# EAGLE design monotype_punch_interface (EAGLE 6.4)
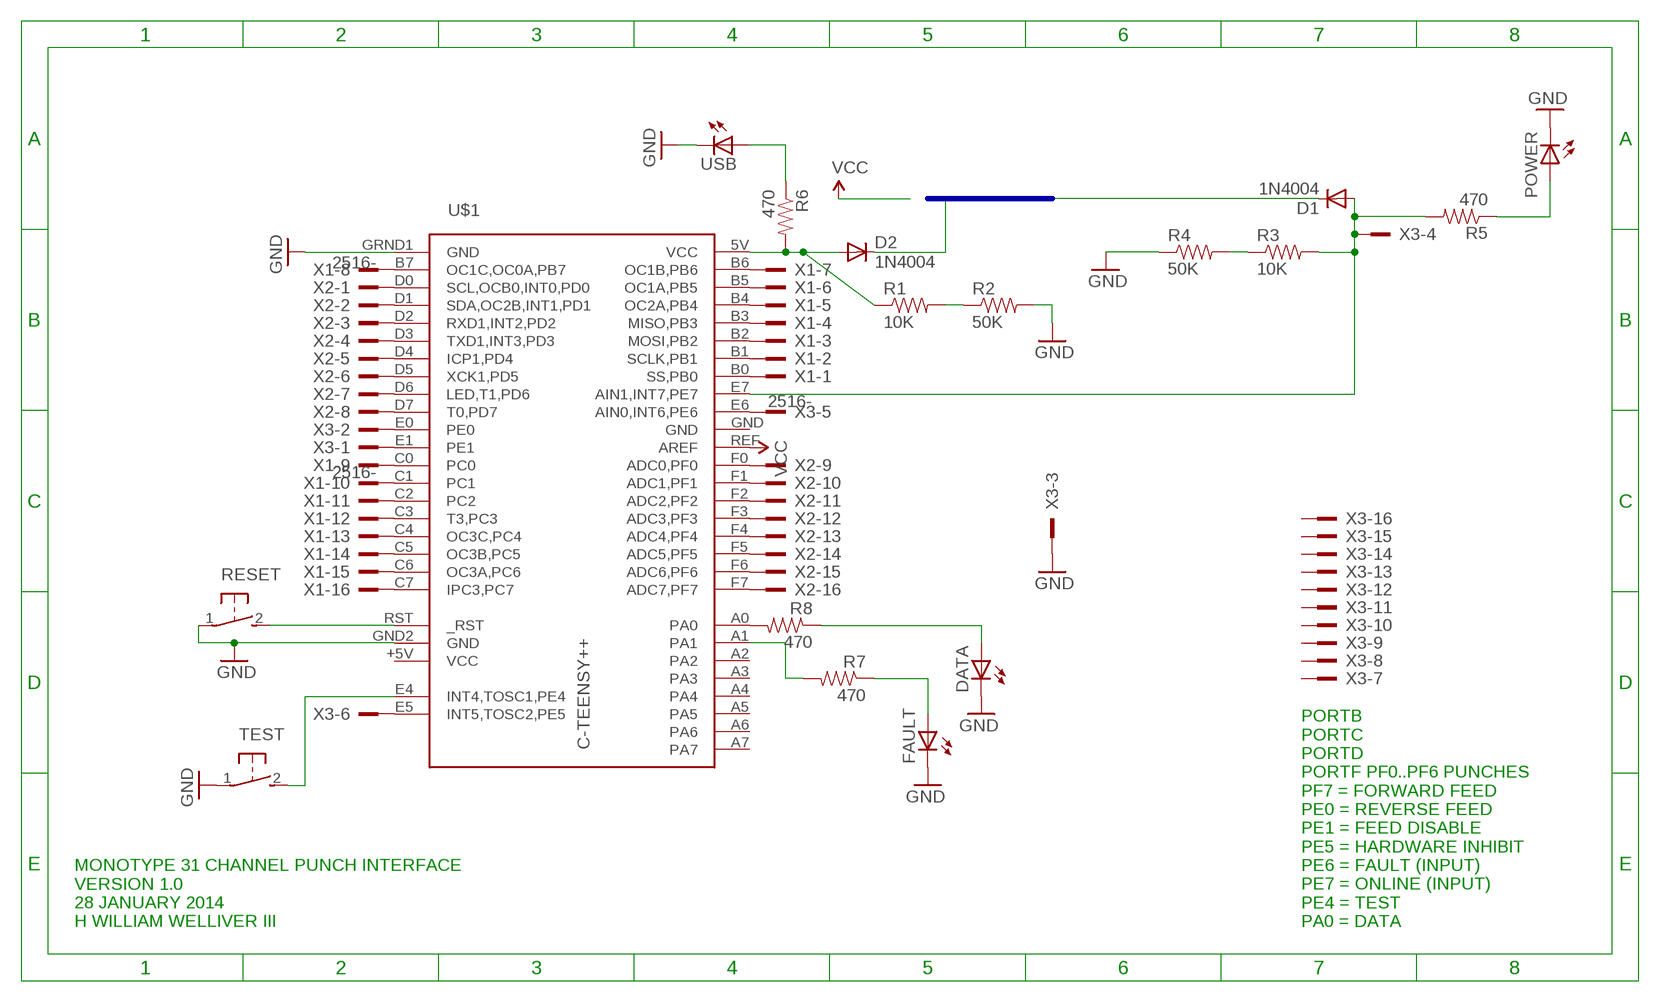
[diagram p0: schematic, sheet 1]

## Parts
D1  1N4004  [DO41-10]
D2  1N4004  [DO41-10]
DATA  LED3MM  [LED3MM]
FAULT  LED3MM  [LED3MM]
POWER  LED3MM  [LED3MM]
R1  10K  RESISTORPTH-1/4W  [AXIAL-0.4]
R2  50K  RESISTORPTH-1/4W  [AXIAL-0.4]
R3  10K  RESISTORPTH-1/4W  [AXIAL-0.4]
R4  50K  RESISTORPTH-1/4W  [AXIAL-0.4]
R5  470  RESISTORPTH-1/4W  [AXIAL-0.4]
R6  470  RESISTORPTH-1/4W  [AXIAL-0.4]
R7  470  RESISTORPTH-1/4W  [AXIAL-0.4]
R8  470  RESISTORPTH-1/4W  [AXIAL-0.4]
RESET  EVQPF  [EVQPF]
TEST  EVQPF  [EVQPF]
U$1  C-TEENSY++  [TEENSY++]
USB  LED3MM  [LED3MM]
X1  2516-  [PAK100/2500-16]
X2  2516-  [PAK100/2500-16]
X3  2516-  [PAK100/2500-16]

## Nets
GND: DATA.K(C) FAULT.K(C) POWER.K(C) R2.P$2 R4.P$1 RESET.1(P) TEST.1(P) U$1.GND2(GND) U$1.GRND1(GND) USB.K(C) X3.3
N$1: RESET.2(S) U$1.RST(_RST)
N$2: TEST.2(S) U$1.E4(INT4,TOSC1,PE4)
N$3: DATA.A R8.P$1
N$4: FAULT.A R7.P$1
N$5: R6.P$1 USB.A
N$6: POWER.A R5.P$1
N$7: D1.A R3.P$2 R5.P$2 U$1.E7(AIN1,INT7,PE7) X3.4
N$8: R3.P$1 R4.P$2
N$9: R1.P$2 R2.P$1
N$10: U$1.B0(SS,PB0) X1.1
N$12: U$1.B1(SCLK,PB1) X1.2
N$13: U$1.B2(MOSI,PB2) X1.3
N$14: U$1.B3(MISO,PB3) X1.4
N$15: U$1.B4(OC2A,PB4) X1.5
N$16: U$1.B5(OC1A,PB5) X1.6
N$17: U$1.B6(OC1B,PB6) X1.7
N$18: U$1.B7(OC1C,OC0A,PB7) X1.8
N$19: U$1.C0 X1.9
N$20: U$1.C1 X1.10
N$21: U$1.C2 X1.11
N$22: U$1.C3(T3,PC3) X1.12
N$23: U$1.C4(OC3C,PC4) X1.13
N$24: U$1.C5(OC3B,PC5) X1.14
N$25: U$1.C6(OC3A,PC6) X1.15
N$26: U$1.C7(IPC3,PC7) X1.16
N$27: U$1.D0(SCL,OCB0,INT0,PD0) X2.1
N$28: U$1.D1(SDA,OC2B,INT1,PD1) X2.2
N$29: U$1.D2(RXD1,INT2,PD2) X2.3
N$30: U$1.D3(TXD1,INT3,PD3) X2.4
N$31: U$1.D4(ICP1,PD4) X2.5
N$32: U$1.D5(XCK1,PD5) X2.6
N$33: U$1.D6(LED,T1,PD6) X2.7
N$34: U$1.D7(T0,PD7) X2.8
N$35: U$1.F0(ADC0,PF0) X2.9
N$36: U$1.F1(ADC1,PF1) X2.10
N$37: U$1.F2(ADC2,PF2) X2.11
N$38: U$1.F3(ADC3,PF3) X2.12
N$39: U$1.F4(ADC4,PF4) X2.13
N$40: U$1.F5(ADC5,PF5) X2.14
N$41: U$1.F6(ADC6,PF6) X2.15
N$42: U$1.F7(ADC7,PF7) X2.16
N$43: U$1.E1 X3.1
N$44: U$1.E0 X3.2
N$45: U$1.E6(AIN0,INT6,PE6) X3.5
N$46: U$1.E5(INT5,TOSC2,PE5) X3.6
N$47: R8.P$2 U$1.A0
N$48: R7.P$2 U$1.A1
V2: D1.C D2.A D2.C R1.P$1 R6.P$2 U$1.5V(VCC) U$1.REF(AREF) ; supply symbol labelled VCC
Unconnected: U$1.A2 U$1.A3 U$1.A4 U$1.A5 U$1.A6 U$1.A7 X3.7 X3.8 X3.9 X3.10 X3.11 X3.12 X3.13 X3.14 X3.15 X3.16

## Buses
VCC

## Notes on the sheet
- MONOTYPE 31 CHANNEL PUNCH INTERFACE
  VERSION 1.0
  28 JANUARY 2014
  H WILLIAM WELLIVER III
- PORTB
  PORTC
  PORTD
  PORTF PF0..PF6 PUNCHES
  PF7 = FORWARD FEED
  PE0 = REVERSE FEED
  PE1 = FEED DISABLE
  PE5 = HARDWARE INHIBIT
  PE6 = FAULT (INPUT)
  PE7 = ONLINE (INPUT)
  PE4 = TEST
  PA0 = DATA

## Power pins joined to a net without a drawn wire
GND: U$1.GND
V2: U$1.+5V(VCC)

## Library data of the parts
D1 D2 = diode:1N4004: DIODE general purpose rectifier, 1 A
DATA FAULT POWER USB = led:LED: LED OSRAM: - CHIPLED LG R971, LG N971, LY N971, LG Q971, LY Q971, LO R971, LY R971 LH N974, LH R974 LS Q976, LO Q976, LY Q976 LO Q996 - Hyper CHIPLED LW Q18S LB Q993, LB Q99A, LB R99A - SideLED LS A670, LO A670, LY A670, LG A670, LP A670 LB A673, LV A673, LT A673, LW A673 LH A674 LY A675 LS A676, LA A676, LO A676, LY A676, LW A676 LS A679, LY A679, LG A679 - Hyper Micro SIDELED® LS Y876, LA Y876, LO Y876, LY Y876 LT Y87S - SmartLED LW L88C, LW L88S LB L89C, LB L89S, LG L890 LS L89K, LO L89K, LY L89K LS L896, LA L896, LO L896, LY L896 - TOPLED LS T670, LO T670, LY T670, LG T670, LP T670 LSG T670, LSP T670, LSY T670, LOP T670, LYG T670 LG T671, LOG T671, LSG T671 LB T673, LV T673, LT T673, LW T673 LH T674 LS T676, LA T676, LO T676, LY T676, LB T676, LH T676, LSB T676, LW T676 LB T67C, LV T67C, LT T67C, LS T67K, LO T67K, LY T67K, LW E67C LS E67B, LA E67B, LO E67B, LY E67B, LB E67C, LV E67C, LT E67C LW T67C LS T679, LY T679, LG T679 LS T770, LO T770, LY T770, LG T770, LP T770 LB T773, LV T773, LT T773, LW T773 LH T774 LS E675, LA E675, LY E675, LS T675 LS T776, LA T776, LO T776, LY T776, LB T776 LHGB T686 LT T68C, LB T68C - Hyper Mini TOPLED® LB M676 - Mini TOPLED Santana® LG M470 LS M47K, LO M47K, LY M47K Source: http://www.osram.convergy.de LUXEON: - LUMILED® LXK2-PW12-R00, LXK2-PW12-S00, LXK2-PW14-U00, LXK2-PW14-V00 LXK2-PM12-R00, LXK2-PM12-S00, LXK2-PM14-U00 LXK2-PE12-Q00, LXK2-PE12-R00, LXK2-PE12-S00, LXK2-PE14-T00, LXK2-PE14-U00 LXK2-PB12-K00, LXK2-PB12-L00, LXK2-PB12-M00, LXK2-PB14-N00, LXK2-PB14-P00, LXK2-PB14-Q00 LXK2-PR12-L00, LXK2-PR12-M00, LXK2-PR14-Q00, LXK2-PR14-R00 LXK2-PD12-Q00, LXK2-PD12-R00, LXK2-PD12-S00 LXK2-PH12-R00, LXK2-PH12-S00 LXK2-PL12-P00, LXK2-PL12-Q00, LXK2-PL12-R00 Source: www.luxeon.com KINGBRIGHT: KA-3528ASYC Source: www.kingbright.com
R1-R8 = SparkFun:RESISTOR: Resistor Basic schematic elements and footprints for 0603, 1206, and PTH resistors.
RESET TEST = alchemy:EVQPF: PANASONIC RIGHT ANGLE SWITCH; MPN: EVQPF
U$1 = teensypp:C-TEENSY++
X1-X3 = con-3m:2516-: 3M (TM) Pak 100 4-Wall Header Source: 3M; OC_FARNELL: unknown; OC_NEWARK: unknown

## Board
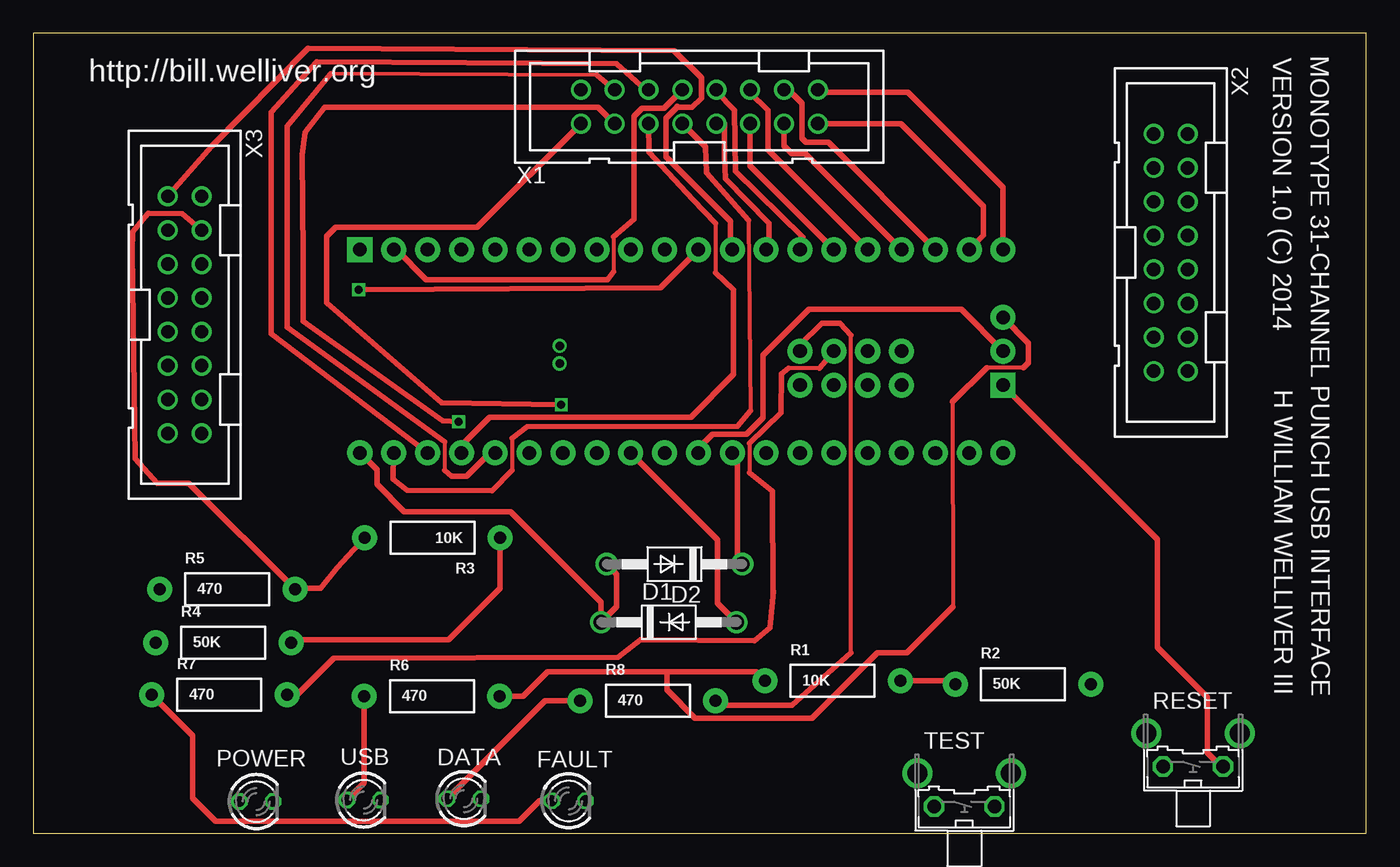
[diagram p1: board, top side]
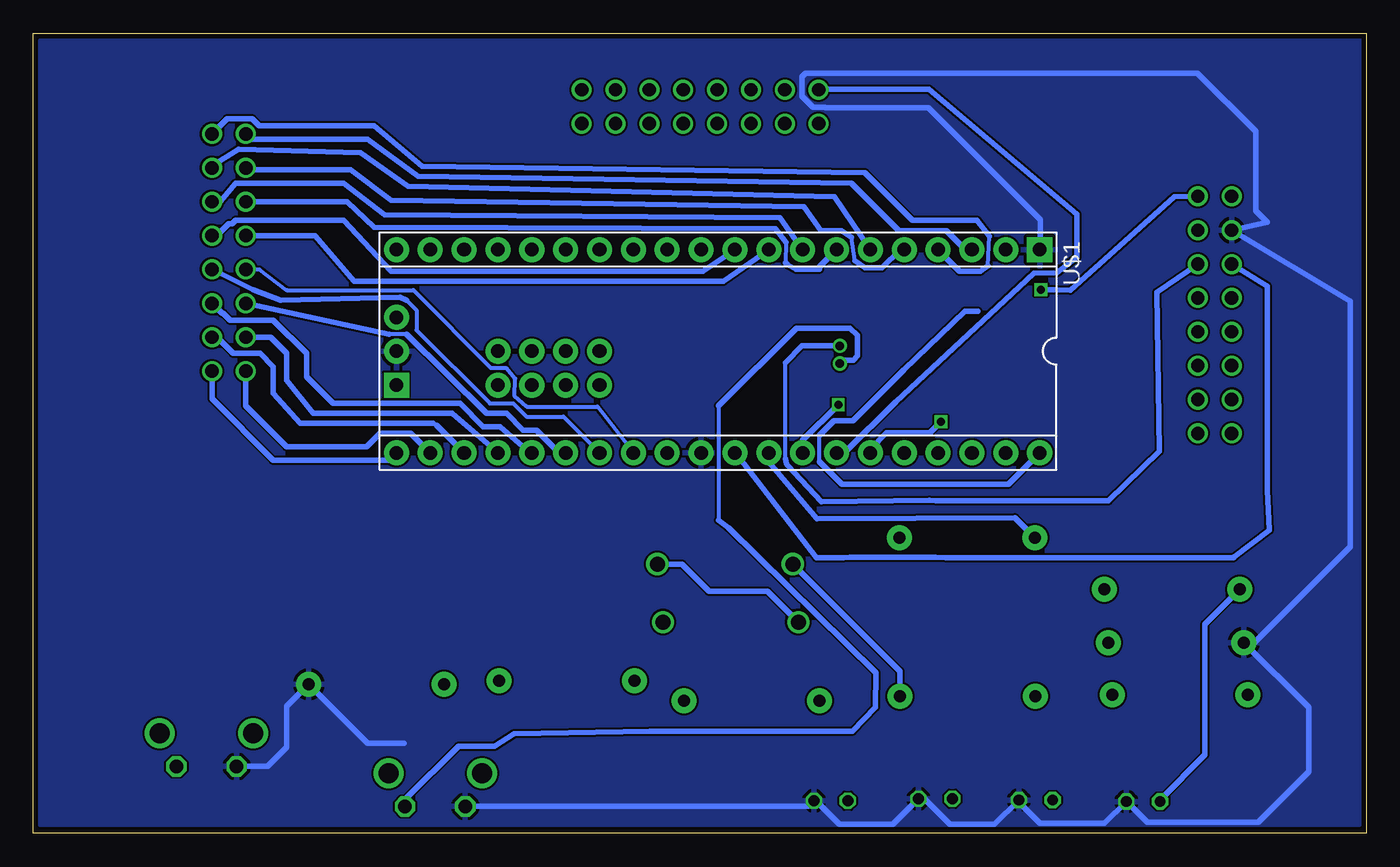
[diagram p2: board, bottom side, seen from below]

Size 100 x 60 mm. Coordinates in mm from the lower left corner, seen from the top.
Outline: 0,0 100,0 100,60 0,60 0,0
Copper layers (1*16): Top 0.0356mm / dielectric 1.5011mm / Bottom 0.0356mm
Design rules "LaenPCBOrder": minimum track width 6mil, minimum drill 13mil, track to track 6mil, track to pad 6mil, pad to pad 6mil, via to via 6mil, smd to smd 6mil, copper to edge 15mil, drill to drill 6mil, minimum pad ring 7mil, minimum via ring 7mil, stop-mask expansion 4mil, vias tented up to drill 0mil, thermal gap 10mil

### Footprints (pad centres in the part's own frame; a part is rotated, then mirrored left to right if it is on the bottom)
DO41-10 = drill 1.118: A 5.08,0; C -5.08,0
LED3MM = drill 0.813 octagon: A -1.27,0; K 1.27,0
AXIAL-0.4 = drill 0.9 pad 1.88: P$1 -5.08,0; P$2 5.08,0
EVQPF = drill 1.016 octagon: 1 -2.261,-1.245; 2 2.261,-1.245 | drill 1.499 pad 2.159: 3 -3.505,1.245; 4 3.505,1.245
TEENSY++ = drill 1.016 pad 1.88: 5V 24.13,-2.54; +5V -24.13,7.62; A0 8.89,0; A1 11.43,0; A2 13.97,0; A3 16.51,0; A4 8.89,2.54; A5 11.43,2.54; A6 13.97,2.54; A7 16.51,2.54; B0 -6.35,7.62; B1 -8.89,7.62; B2 -11.43,7.62; B3 -13.97,7.62; B4 -16.51,7.62; B5 -19.05,7.62; B6 -21.59,7.62; B7 -21.59,-7.62; C0 6.35,-7.62; C1 8.89,-7.62; C2 11.43,-7.62; C3 13.97,-7.62; C4 16.51,-7.62; C5 19.05,-7.62; C6 21.59,-7.62; C7 24.13,-7.62; D0 -19.05,-7.62; D1 -16.51,-7.62; D2 -13.97,-7.62; D3 -11.43,-7.62; D4 -8.89,-7.62; D5 -6.35,-7.62; D6 -3.81,-7.62; D7 -1.27,-7.62; E0 1.27,-7.62; E1 3.81,-7.62; E6 -1.27,7.62; E7 -3.81,7.62; F0 6.35,7.62; F1 8.89,7.62; F2 11.43,7.62; F3 13.97,7.62; F4 16.51,7.62; F5 19.05,7.62; F6 21.59,7.62; F7 24.13,7.62; GND2 24.13,0; GRND1 1.27,7.62; REF 3.81,7.62 | drill 0.635 pad 1.067: E4 -9.144,0.914; E5 -9.144,-0.406 | drill 1.016 pad 1.88 square: GND -24.13,-7.62; RST 24.13,2.54
PAK100/2500-16 = drill 1 pad 1.422: 1 -8.89,-1.27; 2 -8.89,1.27; 3 -6.35,-1.27; 4 -6.35,1.27; 5 -3.81,-1.27; 6 -3.81,1.27; 7 -1.27,-1.27; 8 -1.27,1.27; 9 1.27,-1.27; 10 1.27,1.27; 11 3.81,-1.27; 12 3.81,1.27; 13 6.35,-1.27; 14 6.35,1.27; 15 8.89,-1.27; 16 8.89,1.27

### Placement (x,y rotation side)
D1  47.68,15.83 0 top
D2  48.1,20.19 180 top
DATA  32.31,2.6 0 top
FAULT  40.16,2.44 0 top
POWER  16.73,2.39 0 top
R1  59.97,11.43 0 top
R2  74.25,11.19 0 top
R3  29.95,22.17 180 top
R4  14.25,14.31 0 top
R5  14.55,18.31 0 top
R6  29.91,10.29 0 top
R7  13.95,10.39 0 top
R8  46.11,9.95 0 top
RESET  87.01,6.26 0 top
TEST  69.85,3.26 0 top
U$1  48.63,36.16 180 bottom
USB  24.79,2.5 0 top
X1  49.97,54.5 0 top
X2  85.33,43.56 270 top
X3  11.37,38.89 270 top

### Tracks (layer width: path | path; a pad name or v marks a point on that pad's centre or on a via)
GND
  Top 0.406: U$1.GND2 69.63,39.29 58.19,39.29 54.76,35.86 54.76,31.17 53.5,29.92 50.95,29.92 49.9,28.87 U$1.GRND1
  Bottom 0.406: RESET.1 82.43,5.01 81,6.45 81,9.52 R2.P$2 74.92,6.77 72.19,6.77 | 67.59,2.17 TEST.1 41.86,2.02 FAULT.K 41.29,2.44 39.53,0.68 35.51,0.68 DATA.K 33.14,2.6 31.22,0.68 27.88,0.68 USB.K 26.06,2.33 24.49,0.76 19.63,0.76 POWER.K 17.96,2.39 16.4,0.83 8.09,0.83 4.31,4.61 4.31,9.45 R4.P$1 8.38,14.31 1.21,21.48 1.21,39.9 X3.3 7.43,45.84 8.3,46.71 8.3,52.65 12.66,57.01 42.05,57.01 42.33,56.73 42.33,55.29 41.49,54.46 40.61,54.46 40.57,54.41 32.83,54.41 24.43,46.02 24.43,43.85
  pour Bottom: 0.45,59.42 99.46,59.42 99.46,0.68 0.53,0.68 0.53,59.39
N$1
  Top 0.406: U$1.RST 84.33,22.05 84.33,13.96 88.09,10.21 88.09,6.03 89.11,5.01 RESET.2
N$2
  Bottom 0.305: 48.61,32.06 48.61,23.47
  Bottom 0.406: U$1.E4 39.24,35.49 38.48,35.49 38.16,35.81 38.16,37.34 38.72,37.9 42.75,37.9 48.61,32.06 | 48.61,23.47 47.85,22.92 36.77,12.06 36.81,9.46 38.53,7.65 50.81,7.65 53.73,7.65 63.94,7.47 65.38,6.54 68.11,6.54 72.11,2.54 TEST.2
N$3
  Top 0.406: DATA.A 38.4,9.95 R8.P$1
N$4
  Top 0.406: R7.P$1 11.94,7.32 11.94,2.65 13.68,0.91 36.43,0.91 37.97,2.44 FAULT.A
N$5
  Top 0.406: USB.A 24.83,3.81 R6.P$1
N$6
  Bottom 0.406: R5.P$1 12.09,15.69 12.09,5.9 15.46,2.54 POWER.A
N$7
  Top 0.406: X3.4 11.15,46.47 8.61,46.52 7.47,45.11 7.43,43.67 7.63,28.11 9.29,26.27 11.67,26.27 R5.P$2 19.69,18.37 21.56,18.37 22.81,19.9 R3.P$2 | U$1.E7 51.33,22.03 51.33,17.26 D1.A
  Bottom 0.406: R3.P$2 26.35,23.66 41.22,23.61 44.82,27.81 U$1.E7
N$8
  Top 0.406: R4.P$2 19.54,14.52 31.16,14.52 35.01,18.37 R3.P$1
N$9
  Top 0.406: R2.P$1 68.93,11.43 R1.P$2
N$10  (via drill 0.6)
  Top 0.406: X1.1 33.31,45.46 22.68,45.46 22,44.78 22,39.79 30.62,32.3 v39.61,32.15
  Bottom 0.406: v39.61,32.15 42.28,29.48 U$1.B0
N$12
  Bottom 0.406: X1.2 40.3,55.82 32.81,55.82 21.69,46.44 21.69,44.55 21.69,43.19 23.21,42.05 24.92,42.02 35.3,32.37 39.13,28.54 U$1.B1
N$13  (via drill 0.6)
  Top 0.406: X1.3 42.35,54.46 21.84,54.46 20.41,52.57 20.18,50.91 20.26,43.34 20.26,38.42 30.7,30.94 v31.9,30.86
  Bottom 0.406: v31.9,30.86 32.73,30.03 35.98,30.03 37.2,28.81 U$1.B2
N$14
  Top 0.305: 42.28,56.87 22.3,56.96 | 30.86,29.36 30.86,27.24
  Top 0.406: X1.4 42.28,56.87 | 22.3,56.96 19.05,53.02 19.05,37.97 30.86,29.36 | 30.86,27.24 31.37,26.78 32.5,26.78 34.27,28.54 U$1.B3
N$15
  Top 0.305: 51.18,45.75 51.18,42.04
  Top 0.406: X1.5 46.19,51.08 49.51,47.5 51.18,45.75 | 51.18,42.04 52.53,40.77 52.53,34.42 49.33,31.21 34.22,31.21 32.43,29.43 32.43,27.91 32.12,28.22 U$1.B4
N$16
  Top 0.406: U$1.B5 17.84,37.48 17.84,54.08 21.24,57.86 43.77,57.71 45.94,55.77 X1.6
N$17
  Top 0.305: 53.67,45.99 53.79,31.69 | 35.93,29.64 35.93,27.23
  Top 0.406: X1.7 50.42,51.51 50.49,49.54 53.67,45.99 | 53.79,31.69 52.81,30.52 37.04,30.48 35.93,29.64 | 35.93,27.23 34.4,25.7 28.04,25.72 27.01,26.57 U$1.B6
N$18
  Top 0.305: 43.55,44.76 43.55,42.11
  Top 0.406: X1.8 47.32,54.38 45.66,54.38 45.05,53.78 45.05,46.06 43.55,44.76 | 43.55,42.11 43.08,41.53 29.48,41.53 27.27,43.78 U$1.B7
N$19
  Top 0.406: U$1.C0 55.18,43.78 55.18,45.76 51.92,49.11 51.85,50.75 51.85,53.23 X1.9
N$20
  Top 0.406: U$1.C1 57.75,43.78 57.75,44.7 52.69,49.67 52.61,54.23 51.24,55.6 X1.10
N$21
  Top 0.406: U$1.C2 53.78,50.06 X1.11
N$22
  Top 0.406: U$1.C3 55.1,51.28 55.1,54.23 53.78,55.56 X1.12
N$23
  Top 0.406: U$1.C4 57.94,50.98 56.92,50.98 56.32,51.58 X1.13
N$24
  Top 0.406: U$1.C5 59.65,51.81 57.98,51.81 57.67,52.12 57.67,54.76 56.67,55.77 X1.14
N$25
  Top 0.406: U$1.C6 71.28,44.84 71.28,47.05 65.1,53.23 X1.15
N$26
  Top 0.406: X1.16 59.03,55.59 65.61,55.59 72.76,48.45 U$1.C7
N$27
  Bottom 0.406: X2.1 83.68,52.07 74.93,52.07 71.12,49.28 38.61,48.77 35.05,45.21 31.5,45.21 30.06,43.78 U$1.D0
N$28
  Bottom 0.305: 28.38,42.59 28.27,44.77
  Bottom 0.406: X2.2 85.46,53.59 83.57,53.59 83.06,53.09 74.42,53.09 70.83,50.05 37.59,49.53 34.04,45.97 29.21,45.97 28.27,44.77 | U$1.D1 30.5,42.16 28.96,42.16 28.38,42.59
N$29
  Bottom 0.305: 38.35,42.93 38.61,44.7
  Bottom 0.406: U$1.D2 34.96,43.78 36.32,42.42 37.59,42.42 38.35,42.93 | 38.61,44.7 39.37,45.21 40.89,45.21 42.16,46.99 73.15,47.5 76.2,49.78 83.93,49.78 X2.3
N$30
  Bottom 0.406: X2.4 86.6,50.05 84.58,51.31 75.44,51.05 71.88,48.51 39.9,47.75 U$1.D3
N$31
  Bottom 0.305: 43.54,44.35 43.56,42.78
  Bottom 0.406: X2.5 76.45,47.37 74.42,45.47 44.32,45.34 43.54,44.35 | 43.56,42.78 43.42,42.66 42.8,42.29 41.02,42.29 41.02,42.5 U$1.D4
N$32
  Bottom 0.406: X2.6 85.98,47.37 84.84,48.77 76.71,48.77 73.66,46.41 43.97,46.15 U$1.D5
N$33
  Bottom 0.406: X2.7 78.87,44.83 75.95,41.4 48.21,41.4 U$1.D6
N$34
  Bottom 0.406: X2.8 86.23,44.83 85.34,45.72 85.09,45.72 84.84,45.97 76.71,45.97 73.15,42.16 49.74,42.16 U$1.D7
N$35
  Bottom 0.305: X2.9 83.04,42.29 80.98,40.73 71.48,40.73 65.64,34.89 64.48,34.87 63.85,34.11 63.89,32.77 62.98,32 57.67,32 U$1.F0
N$36
  Bottom 0.305: 71.99,39.99 71.25,39.25 71.25,37.75 65.75,32.25 64,32.25 63,31.25 60.23,31.25 U$1.F1
  Bottom 0.406: X2.10 83.5,40.77 81.45,39.98 72.5,40.19 71.99,39.99
N$37
  Bottom 0.305: 72,37.44 73.31,37.44
  Bottom 0.406: U$1.F2 60.54,28.54 62.25,30.25 63.25,30.25 64.5,31.5 66,31.5 72,37.44 | 73.31,37.44 X2.11
N$38
  Bottom 0.406: 86.5,39.75 X2.12 85.85,39 85.75,39 85.25,38.5 82,38.5 79.5,36 79.5,34.25 77.5,32.25 68,32.25 66.25,30.5 65,30.5 63.29,29.04 U$1.F3 | 86.25,39.75 86.5,39.75 | 86.5,39.75 86.25,39.5 86.25,40
N$39
  Bottom 0.406: X2.13 82.21,37.21 81,36 81,34 79,31.5 68.6,31.5 U$1.F4
N$40
  Bottom 0.406: X2.14 86.21,37.21 85,36 83,36 82,35 82,33 80,30.75 70,30.75 69.75,30.61 U$1.F5
N$41
  Bottom 0.406: X2.15 84.06,32.06 81,29 75,29 74,30 71.68,30 U$1.F6
N$42
  Bottom 0.406: X2.16 86.6,32.6 82,28 73.3,28 U$1.F7
N$43
  Top 0.406: U$1.E1 52.31,43.91 52.31,45.91 47.47,50.75 47.47,53.63 48.3,54.46 48.3,54.54 48.38,54.46 49.44,54.46 50.12,55.14 50.12,56.65 48.07,58.7 20.63,58.88 13.38,51.55 X3.1
N$44  (via drill 0.6)
  Top 0.406: U$1.E0 47.04,40.92 v24.41,40.77
  Bottom 0.406: v24.41,40.77 23.36,40.77 22.19,40.74 14.4,47.74 X3.2
N$45
  Bottom 0.406: X3.5 7.41,41.02 7.41,25.77 7.26,22.74 9.9,20.75 9.98,20.67 31.52,20.67 32.32,20.7 38.75,20.7 39.22,20.65 41.26,20.65 47.31,28.54 U$1.E6
N$46
  Bottom 0.305: 43.57,28.09 43.57,35.28
  Bottom 0.406: X3.6 15.71,40.59 15.54,28.65 19.35,24.93 32.26,24.93 32.78,24.98 40.86,24.87 43.42,27.6 43.5,27.71 43.57,28.09 | 43.57,35.28 42.32,36.57 U$1.E5
N$47
  Top 0.305: 61.34,13.54 61.34,37.34
  Top 0.406: R8.P$2 51.54,9.6 56.93,9.6 61.34,13.54 | 61.34,37.34 60.5,38.27 59.16,38.27 57.52,36.63 U$1.A0
N$48
  Top 0.305: 58.97,34.88 56.66,34.88 | 53.73,29.27 53.73,27.04
  Top 0.406: U$1.A1 58.97,34.88 | 56.66,34.88 56.15,34.47 56.1,31.54 53.73,29.27 | 53.73,27.04 55.45,25.65 55.5,17.91 55.55,18.14 55.27,15.4 54.11,14.43 45.57,14.52 43.85,13.22 22.53,13.13 19.8,10.39 R7.P$2
V2
  Top 0.305: 74.28,34.91 71.54,34.91 | 68.97,32.38 68.99,16.98
  Top 0.406: U$1.+5V 25.78,27.26 25.78,26.16 27.82,24.12 35.8,24.12 42.6,17.32 D1.C 43.77,17.01 43.77,19.44 D2.A | R1.P$1 54.21,12.11 47.53,12.11 | 47.53,12.11 38.57,12.11 36.76,10.29 R6.P$2 | U$1.5V 74.65,36.76 74.65,35.3 74.28,34.91 | 71.54,34.91 68.97,32.38 | 68.99,16.98 65.56,13.54 63.34,13.54 58.42,8.63 49.66,8.63 47.53,10.76 47.53,12.11 | U$1.REF 52.83,28.15 52.83,20.88 53.18,20.53 D2.C
  Bottom 0.305: 41.03,27.89 41.03,29.85
  Bottom 0.406: D1.C 44.9,18.14 49.29,18.14 51.34,20.19 D2.C | U$1.+5V 26.85,26.19 39.33,26.19 41.03,27.89 | 41.03,29.85 39.93,30.95 38.49,30.95 34.68,34.76 30.11,39.15 29.13,39.15 | D2.A 34.99,12.16 R6.P$2

### Text on the board
tPlace: VERSION 1.0 (C) 2014 | MONOTYPE 31-CHANNEL PUNCH USB INTERFACE | http://bill.welliver.org | H WILLIAM WELLIVER III